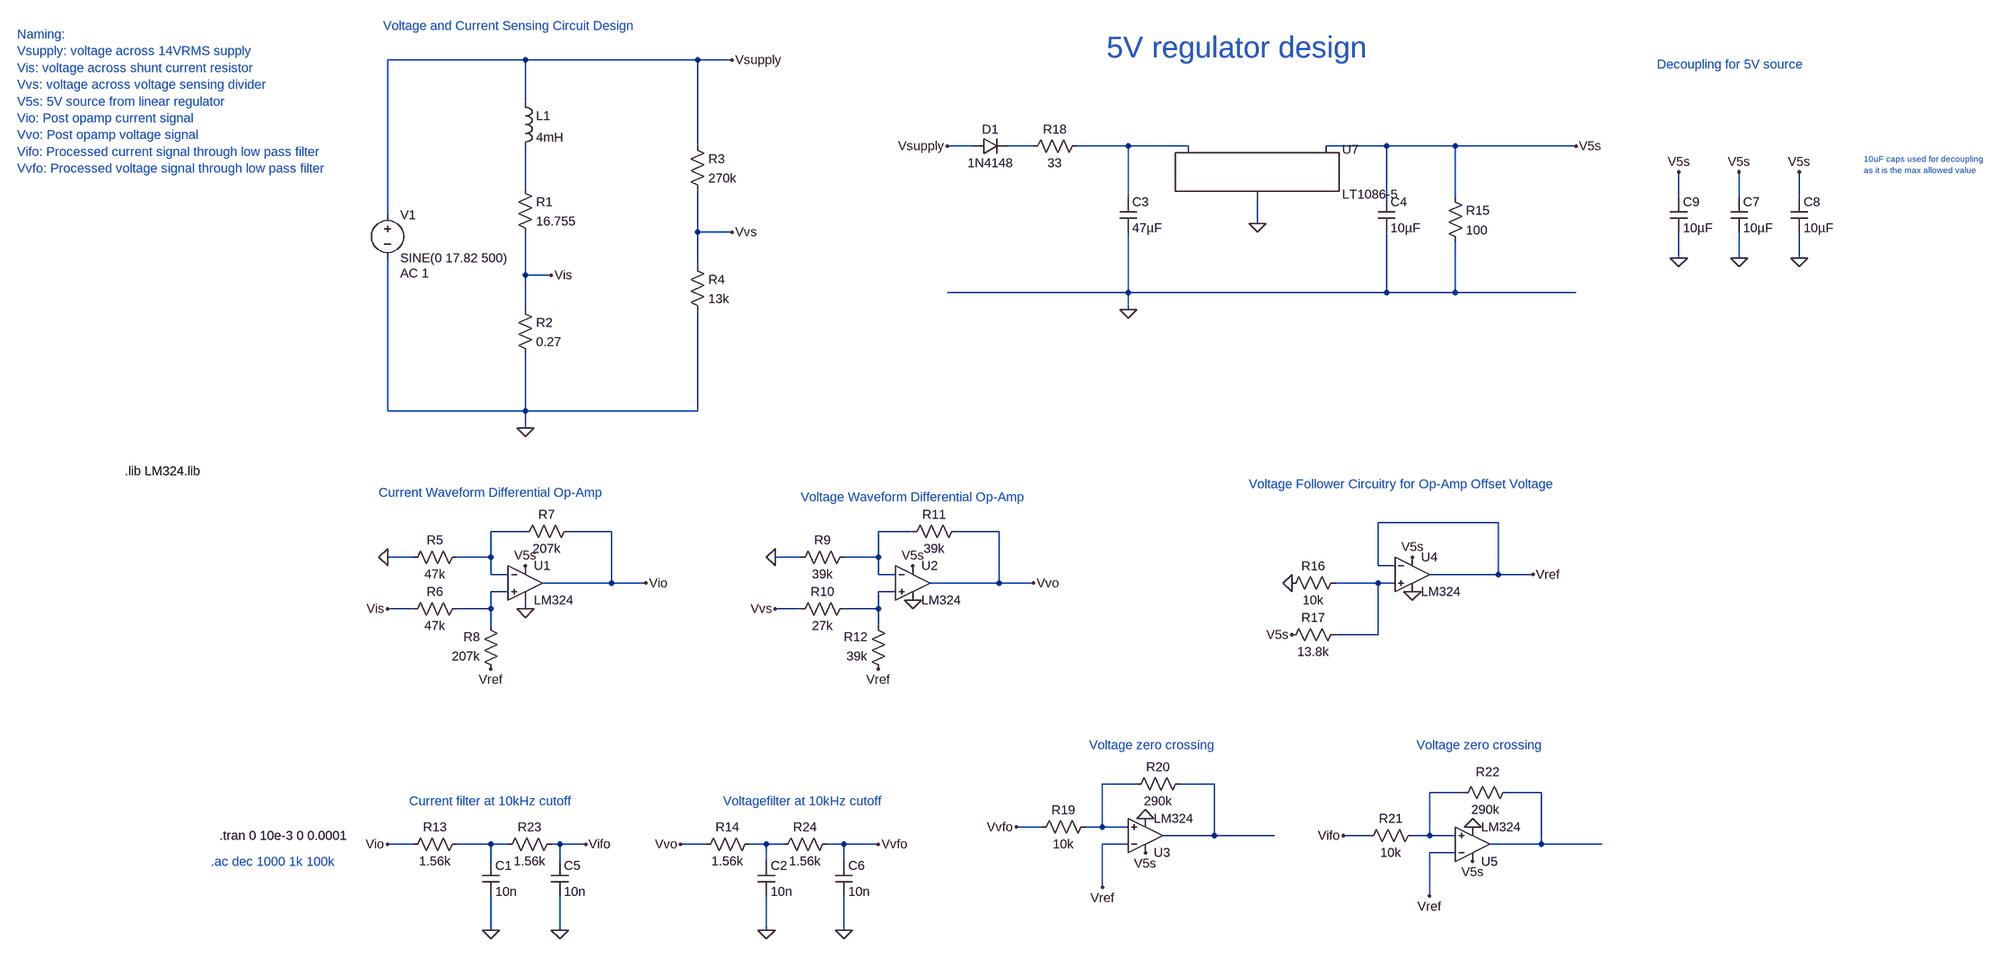
[diagram p0: schematic completed_schematics.asc]
completed_schematics.asc, the LTspice schematic file:
Version 4
SHEET 1 3164 2148
WIRE -256 48 -512 48
WIRE 64 48 -256 48
WIRE 128 48 64 48
WIRE -256 128 -256 48
WIRE 64 208 64 48
WIRE 576 208 528 208
WIRE 688 208 640 208
WIRE 864 208 768 208
WIRE 976 208 864 208
WIRE 1344 208 1232 208
WIRE 1472 208 1344 208
WIRE 1696 208 1472 208
WIRE -256 288 -256 208
WIRE 864 304 864 208
WIRE 1344 304 1344 208
WIRE 1472 304 1472 208
WIRE 2112 304 2112 256
WIRE 2224 304 2224 256
WIRE 2336 304 2336 256
WIRE -512 336 -512 48
WIRE 1104 352 1104 304
WIRE 64 368 64 288
WIRE 128 368 64 368
WIRE 2112 416 2112 368
WIRE 2224 416 2224 368
WIRE 2336 416 2336 368
WIRE 64 432 64 368
WIRE -256 448 -256 368
WIRE -208 448 -256 448
WIRE 864 480 864 368
WIRE 864 480 528 480
WIRE 1344 480 1344 368
WIRE 1344 480 864 480
WIRE 1472 480 1472 384
WIRE 1472 480 1344 480
WIRE 1696 480 1472 480
WIRE -256 512 -256 448
WIRE 864 512 864 480
WIRE -512 720 -512 416
WIRE -256 720 -256 592
WIRE -256 720 -512 720
WIRE 64 720 64 512
WIRE 64 720 -256 720
WIRE -256 752 -256 720
WIRE 1552 928 1328 928
WIRE -256 944 -320 944
WIRE -96 944 -176 944
WIRE 464 944 400 944
WIRE 624 944 544 944
WIRE -464 992 -512 992
WIRE -320 992 -320 944
WIRE -320 992 -384 992
WIRE 256 992 208 992
WIRE 400 992 400 944
WIRE 400 992 336 992
WIRE 1328 1008 1328 928
WIRE 1360 1008 1328 1008
WIRE -320 1024 -320 992
WIRE -288 1024 -320 1024
WIRE 400 1024 400 992
WIRE 432 1024 400 1024
WIRE 1552 1024 1552 928
WIRE 1552 1024 1424 1024
WIRE 1616 1024 1552 1024
WIRE -96 1040 -96 944
WIRE -96 1040 -224 1040
WIRE -32 1040 -96 1040
WIRE 624 1040 624 944
WIRE 624 1040 496 1040
WIRE 688 1040 624 1040
WIRE 1328 1040 1248 1040
WIRE 1360 1040 1328 1040
WIRE -288 1056 -320 1056
WIRE 432 1056 400 1056
WIRE -464 1088 -512 1088
WIRE -320 1088 -320 1056
WIRE -320 1088 -384 1088
WIRE -256 1088 -256 1072
WIRE 256 1088 208 1088
WIRE 400 1088 400 1056
WIRE 400 1088 336 1088
WIRE -320 1120 -320 1088
WIRE 400 1120 400 1088
WIRE 1328 1136 1328 1040
WIRE 1328 1136 1248 1136
WIRE 880 1440 816 1440
WIRE 1024 1440 960 1440
WIRE 1488 1456 1424 1456
WIRE 1632 1456 1568 1456
WIRE 704 1520 656 1520
WIRE 816 1520 816 1440
WIRE 816 1520 784 1520
WIRE 864 1520 816 1520
WIRE 1024 1536 1024 1440
WIRE 1024 1536 928 1536
WIRE 1136 1536 1024 1536
WIRE 1312 1536 1264 1536
WIRE 1424 1536 1424 1456
WIRE 1424 1536 1392 1536
WIRE 1472 1536 1424 1536
WIRE -464 1552 -512 1552
WIRE -320 1552 -384 1552
WIRE -288 1552 -320 1552
WIRE -192 1552 -208 1552
WIRE -144 1552 -192 1552
WIRE 80 1552 32 1552
WIRE 192 1552 160 1552
WIRE 224 1552 192 1552
WIRE 336 1552 304 1552
WIRE 400 1552 336 1552
WIRE 864 1552 816 1552
WIRE 1632 1552 1632 1456
WIRE 1632 1552 1536 1552
WIRE 1744 1552 1632 1552
WIRE 1472 1568 1424 1568
WIRE -320 1584 -320 1552
WIRE -192 1584 -192 1552
WIRE 192 1584 192 1552
WIRE 336 1584 336 1552
WIRE 816 1632 816 1552
WIRE 1424 1648 1424 1568
WIRE -320 1712 -320 1648
WIRE -192 1712 -192 1648
WIRE 192 1712 192 1648
WIRE 336 1712 336 1648
FLAG -256 752 0
FLAG 128 48 Vsupply
FLAG 128 368 Vvs
FLAG -208 448 Vis
FLAG -320 1200 Vref
FLAG -512 992 0
FLAG -512 1088 Vis
FLAG -32 1040 Vio
FLAG 400 1200 Vref
FLAG 464 1072 0
FLAG 464 1008 V5s
FLAG 208 992 0
FLAG 208 1088 Vvs
FLAG 688 1040 Vvo
FLAG 864 512 0
FLAG 1392 1056 0
FLAG 1392 992 V5s
FLAG 1616 1024 Vref
FLAG -512 1552 Vio
FLAG 32 1552 Vvo
FLAG 1696 208 V5s
FLAG 528 208 Vsupply
FLAG 1104 352 0
FLAG 1168 1040 0
FLAG 1168 1136 V5s
FLAG -256 1088 0
FLAG -256 1008 V5s
FLAG 656 1520 Vvfo
FLAG 816 1632 Vref
FLAG 1264 1536 Vifo
FLAG 1424 1648 Vref
FLAG 896 1504 0
FLAG 896 1568 V5s
FLAG 1504 1520 0
FLAG 1504 1584 V5s
FLAG -320 1712 0
FLAG 192 1712 0
FLAG -192 1712 0
FLAG -144 1552 Vifo
FLAG 336 1712 0
FLAG 400 1552 Vvfo
FLAG 2224 416 0
FLAG 2224 256 V5s
FLAG 2336 416 0
FLAG 2336 256 V5s
FLAG 2112 416 0
FLAG 2112 256 V5s
SYMBOL cap 848 304 R0
SYMATTR InstName C3
SYMATTR Value 47µF
SYMBOL cap 1328 304 R0
SYMATTR InstName C4
SYMATTR Value 10µF
SYMBOL res 1456 288 R0
SYMATTR InstName R15
SYMATTR Value 100
SYMBOL diode 576 224 R270
WINDOW 0 32 32 VTop 2
WINDOW 3 0 32 VBottom 2
SYMATTR InstName D1
SYMATTR Value 1N4148
SYMBOL res 784 192 R90
WINDOW 0 0 56 VBottom 2
WINDOW 3 32 56 VTop 2
SYMATTR InstName R18
SYMATTR Value 33
SYMBOL voltage -512 320 R0
WINDOW 123 24 124 Left 2
WINDOW 39 0 0 Left 0
SYMATTR Value2 AC 1
SYMATTR InstName V1
SYMATTR Value SINE(0 17.82 500)
SYMBOL ind -272 112 R0
SYMATTR InstName L1
SYMATTR Value 4mH
SYMBOL res -272 272 R0
SYMATTR InstName R1
SYMATTR Value 16.755
SYMBOL res -272 496 R0
SYMATTR InstName R2
SYMATTR Value 0.27
SYMBOL res 48 192 R0
SYMATTR InstName R3
SYMATTR Value 270k
SYMBOL res 48 416 R0
SYMATTR InstName R4
SYMATTR Value 13k
SYMBOL res -368 976 R90
WINDOW 0 0 56 VBottom 2
WINDOW 3 32 56 VTop 2
SYMATTR InstName R5
SYMATTR Value 47k
SYMBOL res -368 1072 R90
WINDOW 0 0 56 VBottom 2
WINDOW 3 32 56 VTop 2
SYMATTR InstName R6
SYMATTR Value 47k
SYMBOL res -160 928 R90
WINDOW 0 0 56 VBottom 2
WINDOW 3 32 56 VTop 2
SYMATTR InstName R7
SYMATTR Value 207k
SYMBOL res -304 1216 R180
WINDOW 0 36 76 Left 2
WINDOW 3 36 40 Left 2
SYMATTR InstName R8
SYMATTR Value 207k
SYMBOL res 352 976 R90
WINDOW 0 0 56 VBottom 2
WINDOW 3 32 56 VTop 2
SYMATTR InstName R9
SYMATTR Value 39k
SYMBOL res 352 1072 R90
WINDOW 0 0 56 VBottom 2
WINDOW 3 32 56 VTop 2
SYMATTR InstName R10
SYMATTR Value 27k
SYMBOL res 560 928 R90
WINDOW 0 0 56 VBottom 2
WINDOW 3 32 56 VTop 2
SYMATTR InstName R11
SYMATTR Value 39k
SYMBOL res 416 1216 R180
WINDOW 0 36 76 Left 2
WINDOW 3 36 40 Left 2
SYMATTR InstName R12
SYMATTR Value 39k
SYMBOL cap -336 1584 R0
SYMATTR InstName C1
SYMATTR Value 10n
SYMBOL res -368 1536 R90
WINDOW 0 0 56 VBottom 2
WINDOW 3 32 56 VTop 2
SYMATTR InstName R13
SYMATTR Value 1.56k
SYMBOL cap 176 1584 R0
SYMATTR InstName C2
SYMATTR Value 10n
SYMBOL res 176 1536 R90
WINDOW 0 0 56 VBottom 2
WINDOW 3 32 56 VTop 2
SYMATTR InstName R14
SYMATTR Value 1.56k
SYMBOL res 1264 1024 R90
WINDOW 0 0 56 VBottom 2
WINDOW 3 32 56 VTop 2
SYMATTR InstName R16
SYMATTR Value 10k
SYMBOL res 1264 1120 R90
WINDOW 0 0 56 VBottom 2
WINDOW 3 32 56 VTop 2
SYMATTR InstName R17
SYMATTR Value 13.8k
SYMBOL res 800 1504 R90
WINDOW 0 0 56 VBottom 2
WINDOW 3 32 56 VTop 2
SYMATTR InstName R19
SYMATTR Value 10k
SYMBOL res 976 1424 R90
WINDOW 0 0 56 VBottom 2
WINDOW 3 32 56 VTop 2
SYMATTR InstName R20
SYMATTR Value 290k
SYMBOL res 1408 1520 R90
WINDOW 0 0 56 VBottom 2
WINDOW 3 32 56 VTop 2
SYMATTR InstName R21
SYMATTR Value 10k
SYMBOL res 1584 1440 R90
WINDOW 0 -7 52 VBottom 2
WINDOW 3 32 56 VTop 2
SYMATTR InstName R22
SYMATTR Value 290k
SYMBOL OpAmps\\opamp2 -256 976 R0
SYMATTR InstName U1
SYMATTR Value LM324
SYMBOL OpAmps\\opamp2 464 976 R0
SYMATTR InstName U2
SYMATTR Value LM324
SYMBOL OpAmps\\opamp2 1392 960 R0
SYMATTR InstName U4
SYMATTR Value LM324
SYMBOL PowerProducts\\LT1086-5 1104 208 R0
SYMATTR InstName U7
SYMBOL OpAmps\\opamp2 896 1600 M180
SYMATTR InstName U3
SYMATTR Value LM324
SYMBOL OpAmps\\opamp2 1504 1616 M180
SYMATTR InstName U5
SYMATTR Value LM324
SYMBOL res -192 1536 R90
WINDOW 0 0 56 VBottom 2
WINDOW 3 32 56 VTop 2
SYMATTR InstName R23
SYMATTR Value 1.56k
SYMBOL cap -208 1584 R0
SYMATTR InstName C5
SYMATTR Value 10n
SYMBOL res 320 1536 R90
WINDOW 0 0 56 VBottom 2
WINDOW 3 32 56 VTop 2
SYMATTR InstName R24
SYMATTR Value 1.56k
SYMBOL cap 320 1584 R0
SYMATTR InstName C6
SYMATTR Value 10n
SYMBOL cap 2208 304 R0
SYMATTR InstName C7
SYMATTR Value 10µF
SYMBOL cap 2320 304 R0
SYMATTR InstName C8
SYMATTR Value 10µF
SYMBOL cap 2096 304 R0
SYMATTR InstName C9
SYMATTR Value 10µF
TEXT -520 -16 Left 2 ;Voltage and Current Sensing Circuit Design
TEXT -528 872 Left 2 ;Current Waveform Differential Op-Amp
TEXT 256 880 Left 2 ;Voltage Waveform Differential Op-Amp
TEXT 1088 856 Left 2 ;Voltage Follower Circuitry for Op-Amp Offset Voltage
TEXT -1200 0 Left 2 ;Naming:\nVsupply: voltage across 14VRMS supply\nVis: voltage across shunt current resistor\nVvs: voltage across voltage sensing divider\nV5s: 5V source from linear regulator\nVio: Post opamp current signal\nVvo: Post opamp voltage signal\nVifo: Processed current signal through low pass filter\nVvfo: Processed voltage signal through low pass filter
TEXT -472 1472 Left 2 ;Current filter at 10kHz cutoff
TEXT -840 1584 Left 2 ;.ac dec 1000 1k 100k
TEXT -824 1536 Left 2 !.tran 0 10e-3 0 0.0001
TEXT -1000 832 Left 2 !.lib LM324.lib
TEXT 824 24 Left 5 ;5V regulator design
TEXT 112 1472 Left 2 ;Voltagefilter at 10kHz cutoff
TEXT 792 1368 Left 2 ;Voltage zero crossing
TEXT 1400 1368 Left 2 ;Voltage zero crossing
TEXT 2072 56 Left 2 ;Decoupling for 5V source
TEXT 2456 232 Left 1 ;10uF caps used for decoupling\nas it is the max allowed value

The netlist it stands for:
* completed_schematics.asc
C3 N002 0 47µF
C4 V5s 0 10µF
R15 V5s 0 100
D1 Vsupply N001 1N4148
R18 N002 N001 33
V1 Vsupply 0 SINE(0 17.82 500) AC 1
L1 Vsupply N003 4mH
R1 N003 Vis 16.755
R2 Vis 0 0.27
R3 Vsupply Vvs 270k
R4 Vvs 0 13k
R5 N004 0 47k
R6 N007 Vis 47k
R7 Vio N004 207k
R8 Vref N007 207k
R9 N005 0 39k
R10 N008 Vvs 27k
R11 Vvo N005 39k
R12 Vref N008 39k
C1 N013 0 10n
R13 N013 Vio 1.56k
C2 N014 0 10n
R14 N014 Vvo 1.56k
R16 N006 0 10k
R17 N006 V5s 13.8k
R19 N009 Vvfo 10k
R20 N010 N009 290k
R21 N011 Vifo 10k
R22 N012 N011 290k
XU1 N007 N004 V5s 0 Vio LM324  ; pins In+ In- V+ V- OUT
XU2 N008 N005 V5s 0 Vvo LM324  ; pins In+ In- V+ V- OUT
XU4 N006 Vref V5s 0 Vref LM324  ; pins In+ In- V+ V- OUT
XU7 0 V5s N002 LT1086-5
XU3 N009 Vref V5s 0 N010 LM324  ; pins In+ In- V+ V- OUT
XU5 N011 Vref V5s 0 N012 LM324  ; pins In+ In- V+ V- OUT
R23 Vifo N013 1.56k
C5 Vifo 0 10n
R24 Vvfo N014 1.56k
C6 Vvfo 0 10n
C7 V5s 0 10µF
C8 V5s 0 10µF
C9 V5s 0 10µF
.model D D
.lib standard.dio
* Voltage and Current Sensing Circuit Design
* Current Waveform Differential Op-Amp
* Voltage Waveform Differential Op-Amp
* Voltage Follower Circuitry for Op-Amp Offset Voltage
* Naming:
* Vsupply: voltage across 14VRMS supply
* Vis: voltage across shunt current resistor
* Vvs: voltage across voltage sensing divider
* V5s: 5V source from linear regulator
* Vio: Post opamp current signal
* Vvo: Post opamp voltage signal
* Vifo: Processed current signal through low pass filter
* Vvfo: Processed voltage signal through low pass filter
* Current filter at 10kHz cutoff
* .ac dec 1000 1k 100k
.tran 0 10e-3 0 0.0001
.lib LM324.lib
* 5V regulator design
* Voltagefilter at 10kHz cutoff
* Voltage zero crossing
* Voltage zero crossing
* Decoupling for 5V source
* 10uF caps used for decoupling
* as it is the max allowed value
.backanno
.end